# Altium schematic sheet Control and Sample.SchDoc
size 431 x 279 mm; Date: Not shown in title block; ApprovedBy: Not shown in title block; CheckedBy: Not shown in title block; Author: Not shown; CompanyName: Not shown in title block; DrawnBy: Bowen; Engineer: Not shown; Organization: Not shown in title block; Address1: Not shown in title block; Address2: Not shown in title block; Address3: Not shown in title block; Address4: Not shown in title block; DocumentNumber: 2; Revision: Use project parameter SCH_Rev; SheetNumber: 2; SheetTotal: 3; PageSetup: Record=PageOptions|CenterHorizontal=True|CenterVertical=True|PrintScale=1.00|XCorrection=1.00|YCorrection=1.00|PrintKind=0|BorderSize=5000000|LeftOffset=0|BottomOffset=0|Orientation=2|PaperLength=1000|PaperWidth=1000|Scale=100|PaperSource=15|PrintQuality=600|MediaType=1|DitherType=10|PaperKind=Letter|PrintScaleMode=1; CurrentTime: Not shown in title block; CurrentDate: Not shown in title block; Time: Not shown in title block; DocumentFullPathAndName: Not shown in title block; DocumentName: Not shown in title block; ModifiedDate: 1/25/2022; ImagePath: Not shown in title block
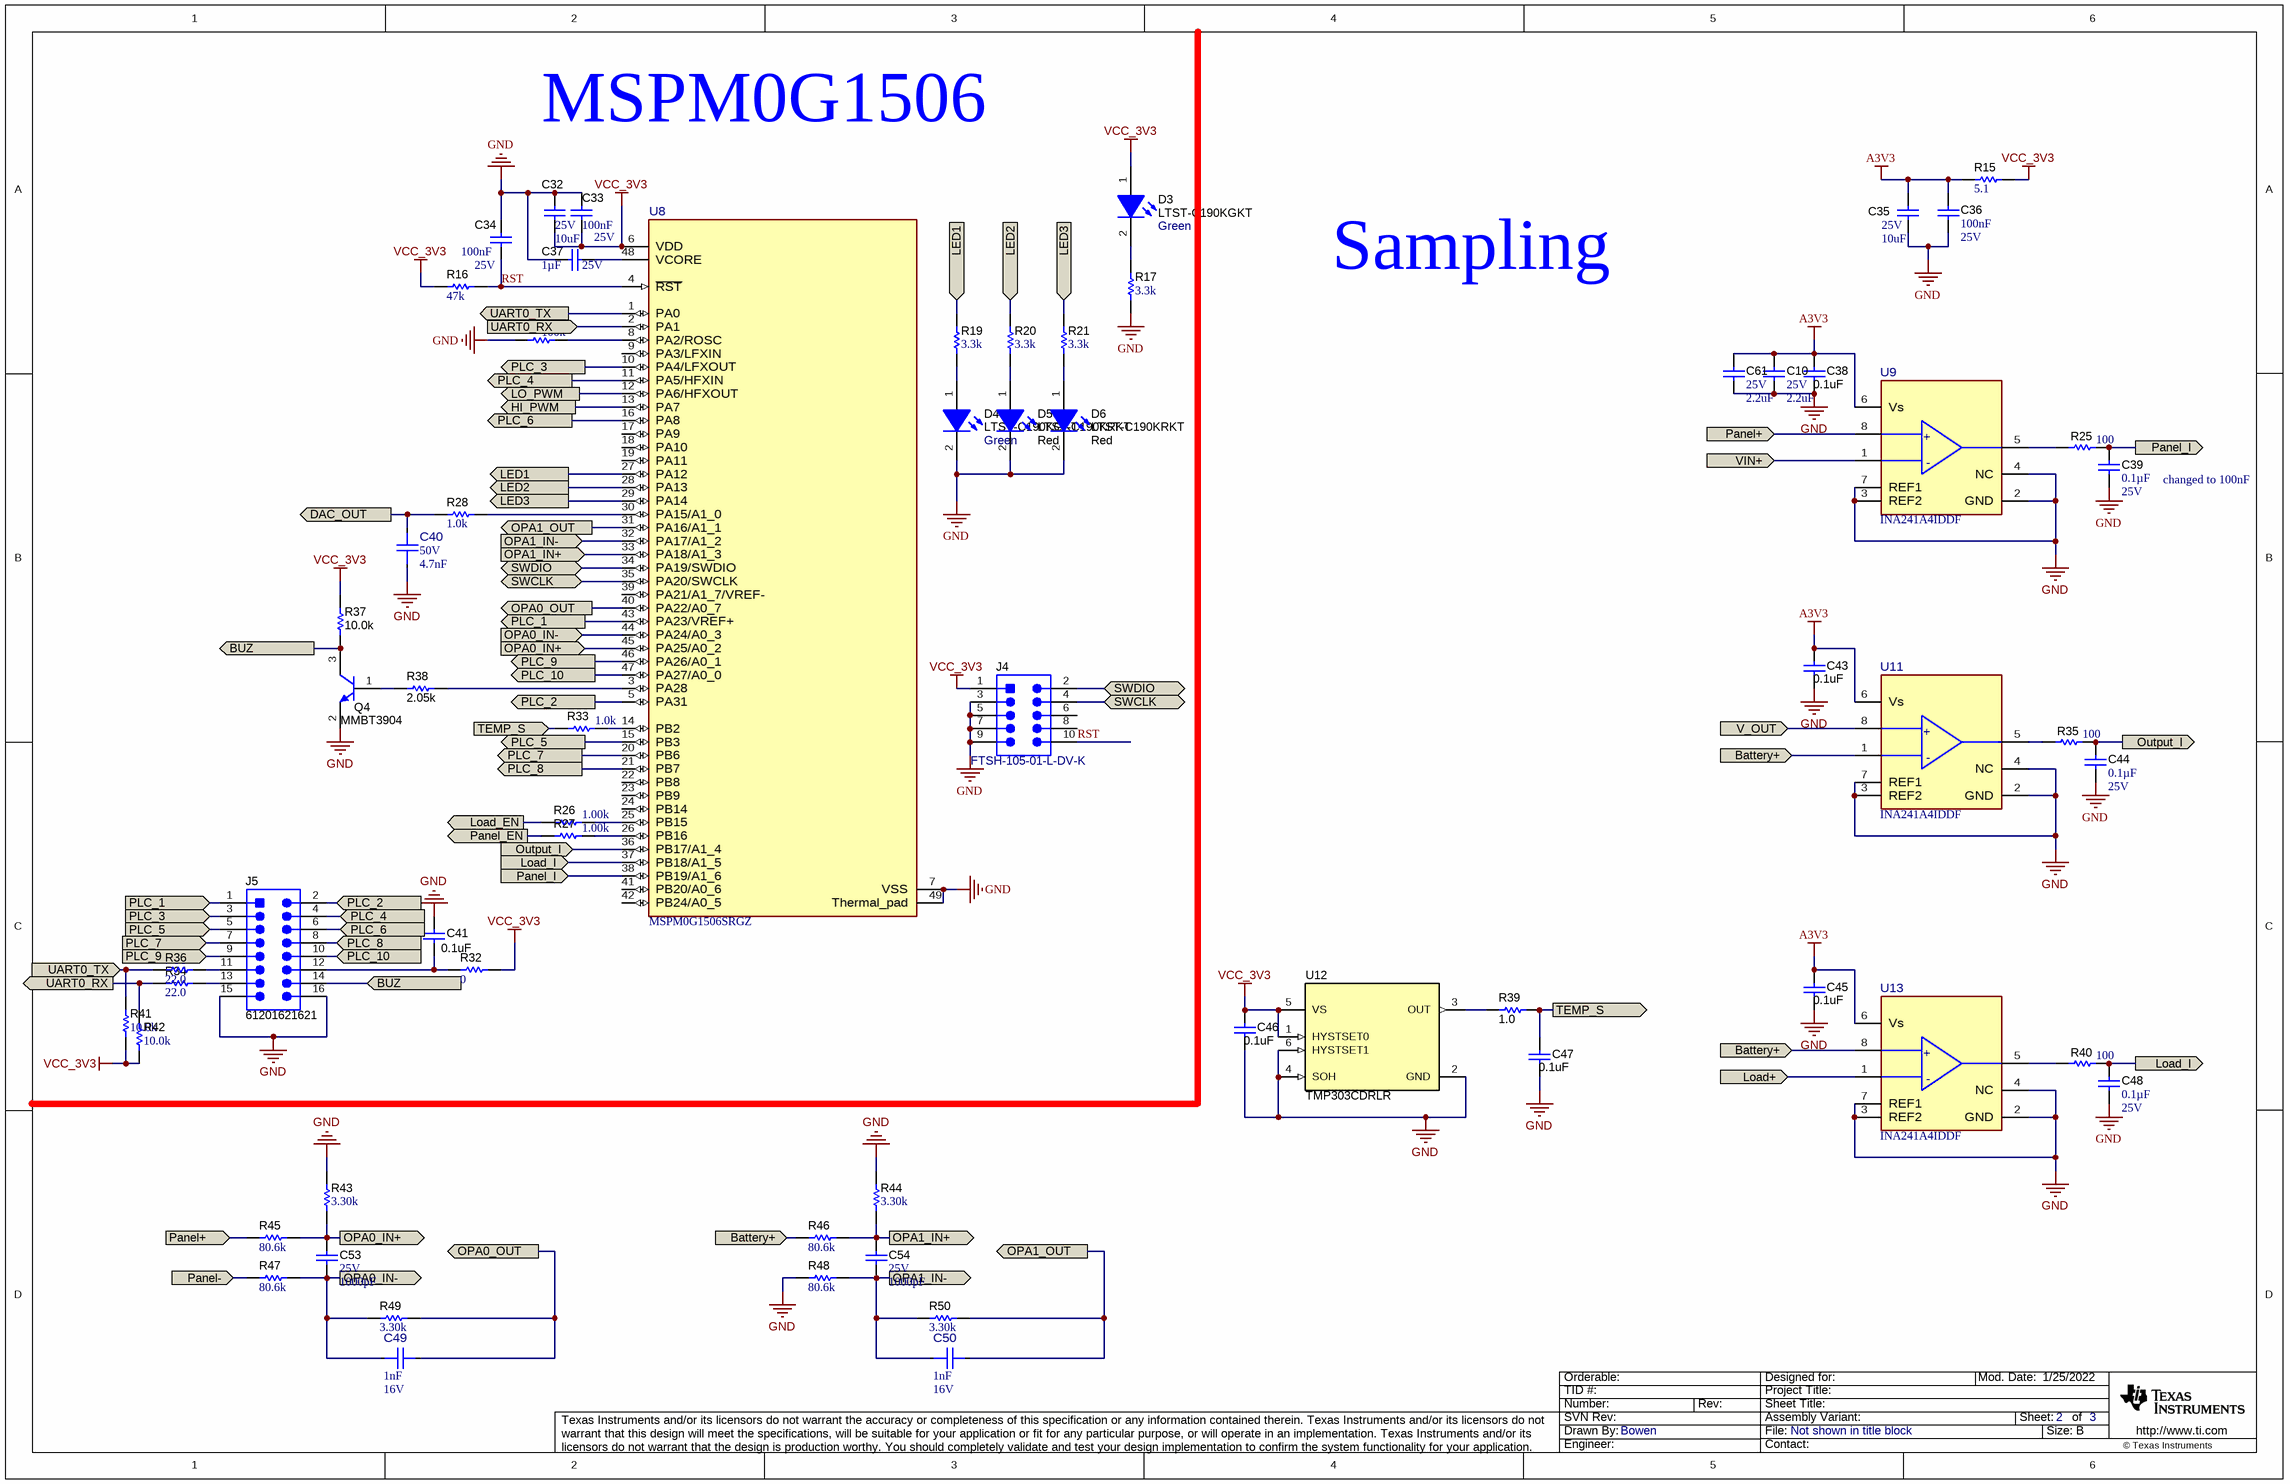
[diagram p0: Control and Sample.SchDoc]

## Parts
C10  VDC_V: 25V  ValueDisplayed: 2.2uF  [0402]  (hidden comment: C1005X5R1E225K050BC)
C32  VDC_V: 25V  ValueDisplayed: 10uF  [1206_180]  (hidden comment: GRM31CR71E106KA12L)
C33  Cap_F: 100nF  VDC_V: 25V  [0603]  (hidden comment: GRM188R71E104KA01D)
C34  Cap_F: 100nF  VDC_V: 25V  [0603]  (hidden comment: GRM188R71E104KA01D)
C35  VDC_V: 25V  ValueDisplayed: 10uF  [1206_180]  (hidden comment: GRM31CR71E106KA12L)
C36  Cap_F: 100nF  VDC_V: 25V  [0603]  (hidden comment: GRM188R71E104KA01D)
C37  Cap_F: 1µF  VDC_V: 25V  [0603]  (hidden comment: 06033C105KAT2A)
C38  ValueDisplayed: 0.1uF  [0603]  (hidden comment: GMK107BJ104KAHT)
C39  ValueDisplayed: 0.1µF  VDC_V: 25V  [0402]  (hidden comment: GCM155L81E104KE02D)
C40  VDC_V: 50V  Cap_F: 4.7nF  [FP-GRM188R71H472KA01B_0603-MFG]  (hidden comment: GRM188R71H472KA01J)
C41  ValueDisplayed: 0.1uF  [0603]  (hidden comment: GMK107BJ104KAHT)
C43  ValueDisplayed: 0.1uF  [0603]  (hidden comment: GMK107BJ104KAHT)
C44  ValueDisplayed: 0.1µF  VDC_V: 25V  [0402]  (hidden comment: GCM155L81E104KE02D)
C45  ValueDisplayed: 0.1uF  [0603]  (hidden comment: GMK107BJ104KAHT)
C46  ValueDisplayed: 0.1uF  [0603]  (hidden comment: GMK107BJ104KAHT)
C47  ValueDisplayed: 0.1uF  [0603]  (hidden comment: GMK107BJ104KAHT)
C48  ValueDisplayed: 0.1µF  VDC_V: 25V  [0402]  (hidden comment: GCM155L81E104KE02D)
C49  Cap_F: 1nF  VDC_V: 16V  [FP-CC0603KRX7R7BB102_0603-MFG]  (hidden comment: CC0603KRX7R7BB102)
C50  Cap_F: 1nF  VDC_V: 16V  [FP-CC0603KRX7R7BB102_0603-MFG]  (hidden comment: CC0603KRX7R7BB102)
C53  VDC_V: 25V  ValueDisplayed: 1000pF  [0402]  (hidden comment: C0402C102J3RACTU)
C54  VDC_V: 25V  ValueDisplayed: 1000pF  [0402]  (hidden comment: C0402C102J3RACTU)
C61  VDC_V: 25V  ValueDisplayed: 2.2uF  [0402]  (hidden comment: C1005X5R1E225K050BC)
D3  LTST-C190KGKT  value Green  [LED_LTST-C190_G]
D4  LTST-C190KGKT  value Green  [LED_LTST-C190_G]
D5  LTST-C190KRKT  value Red  [LED_LTST-C190_Red]
D6  LTST-C190KRKT  value Red  [LED_LTST-C190_Red]
J4  FTSH-105-01-L-DV-K  [Samtec_FTSH-105-01-x-DV-K]
J5  61201621621  [Wurth_61201621621]
Q4  MMBT3904  [SOT-23]
R15  ValueDisplayed: 5.1  [0603]  (hidden comment: CRCW06035R10JNEA)
R16  ValueDisplayed: 47k  [0603]  (hidden comment: RC0603JR-0747KL)
R17  ValueDisplayed: 3.3k  [0603]  (hidden comment: CRCW06033K30JNEA)
R18  ValueDisplayed: 100k  [0603]  (hidden comment: RT0603BRD07100KL)
R19  ValueDisplayed: 3.3k  [0603]  (hidden comment: CRCW06033K30JNEA)
R20  ValueDisplayed: 3.3k  [0603]  (hidden comment: CRCW06033K30JNEA)
R21  ValueDisplayed: 3.3k  [0603]  (hidden comment: CRCW06033K30JNEA)
R25  ValueDisplayed: 100  [0603]  (hidden comment: RC0603FR-07100RL)
R26  ValueDisplayed: 1.00k  [0603]  (hidden comment: RC0603FR-071KL)
R27  ValueDisplayed: 1.00k  [0603]  (hidden comment: RC0603FR-071KL)
R28  ValueDisplayed: 1.0k  [0603]  (hidden comment: RC0603JR-071KL)
R32  ValueDisplayed: 0  [0603]  (hidden comment: RC0603JR-070RL)
R33  ValueDisplayed: 1.0k  [0603]  (hidden comment: RC0603JR-071KL)
R34  ValueDisplayed: 22.0  [0603]  (hidden comment: RC0603FR-0722RL)
R35  ValueDisplayed: 100  [0603]  (hidden comment: RC0603FR-07100RL)
R36  ValueDisplayed: 22.0  [0603]  (hidden comment: RC0603FR-0722RL)
R37  ValueDisplayed: 10.0k  [0603]  (hidden comment: ERJ-3EKF1002V)
R38  ValueDisplayed: 2.05k  [0603]  (hidden comment: RC0603FR-072K05L)
R39  ValueDisplayed: 1.0  [0603]  (hidden comment: CRCW06031R00JNEA)
R40  ValueDisplayed: 100  [0603]  (hidden comment: RC0603FR-07100RL)
R41  ValueDisplayed: 10.0k  [0603]  (hidden comment: RMCF0603FT10K0)
R42  ValueDisplayed: 10.0k  [0603]  (hidden comment: RMCF0603FT10K0)
R43  ValueDisplayed: 3.30k  [0603]  (hidden comment: CRCW06033K30FKEA)
R44  ValueDisplayed: 3.30k  [0603]  (hidden comment: CRCW06033K30FKEA)
R45  ValueDisplayed: 80.6k  [0603]  (hidden comment: RC0603FR-0780K6L)
R46  ValueDisplayed: 80.6k  [0603]  (hidden comment: RC0603FR-0780K6L)
R47  ValueDisplayed: 80.6k  [0603]  (hidden comment: RC0603FR-0780K6L)
R48  ValueDisplayed: 80.6k  [0603]  (hidden comment: RC0603FR-0780K6L)
R49  ValueDisplayed: 3.30k  [0603]  (hidden comment: CRCW06033K30FKEA)
R50  ValueDisplayed: 3.30k  [0603]  (hidden comment: CRCW06033K30FKEA)
U8  MSPM0G1506SRGZ  [RGZ0048B-MFG]
U9  INA241A4IDDF  [DDF0008A-MFG]
U11  INA241A4IDDF  [DDF0008A-MFG]
U12  TMP303CDRLR  [DRL0006A]
U13  INA241A4IDDF  [DDF0008A-MFG]

## Ports
Battery+ (in), BUZ (in), BUZ (out), DAC_OUT (out), HI_PWM (out), LED1 (in), LED1 (out), LED2 (in), LED2 (out), LED3 (in), LED3 (out), LO_PWM (out), Load+ (in), Load_EN (out), Load_I (in), Load_I (out), OPA0_IN+ (in), OPA0_IN+ (out), OPA0_IN- (in), OPA0_IN- (out), OPA0_OUT (out), OPA1_IN+ (in), OPA1_IN+ (out), OPA1_IN- (in), OPA1_IN- (out), OPA1_OUT (out), Output_I (in), Output_I (out), Panel+ (in), Panel- (in), Panel_EN (out), Panel_I (in), Panel_I (out), PLC_1 (in), PLC_1 (out), PLC_2 (in), PLC_2 (out), PLC_3 (in), PLC_3 (out), PLC_4 (in), PLC_4 (out), PLC_5 (in), PLC_5 (out), PLC_6 (in), PLC_6 (out), PLC_7 (in), PLC_7 (out), PLC_8 (in), PLC_8 (out), PLC_9 (in), PLC_9 (out), PLC_10 (in), PLC_10 (out), SWCLK (bidir), SWDIO (bidir), TEMP_S (in), TEMP_S (out), UART0_RX (in), UART0_RX (out), UART0_TX (in), UART0_TX (out), V_OUT (in), VIN+ (in)

## Nets
A3V3: C10.1 C35.1 C36.1 C38.1 C43.1 C45.1 C61.1 R15.1 U9.6(Vs) U11.6(Vs) U13.6(Vs)
GND: C10.2 C32.1 C33.1 C34.1 C35.2 C36.2 C37.1 C38.2 C39.2 C40.1 C41.1 C43.2 C44.2 C45.2 C46.2 C47.2 C48.2 C61.2 D4.2(K) D5.2(K) D6.2(K) J4.3 J4.5 J4.7 J4.9 J5.15 J5.16 Q4.2(E) R17.1 R18.1 R43.2 R44.2 R48.1 U8.7(VSS) U8.49(Thermal_pad) U9.2(GND) U9.3(REF2) U9.4(NC) U9.7(REF1) U11.2(GND) U11.3(REF2) U11.4(NC) U11.7(REF1) U12.2(GND) U12.4(SOH) U12.6(HYSTSET1) U13.2(GND) U13.3(REF2) U13.4(NC) U13.7(REF1)
VCC_3V3: C32.2 C33.2 C46.1 D3.1(A) J4.1 R15.2 R16.1 R32.2 R37.1 R41.1 R42.1 U8.6(VDD) U12.1(HYSTSET0) U12.5(VS)
Battery+: R46.1 U11.1(IN-) U13.8(IN+) ; port Battery+
BUZ: J5.14 Q4.3(C) R37.2 ; port BUZ
DAC_OUT: C40.2 R28.1 ; port DAC_OUT
HI_PWM: U8.13(PA7) ; port HI_PWM
LED1: R19.1 U8.27(PA12) ; port LED1
LED2: R20.1 U8.28(PA13) ; port LED2
LED3: R21.1 U8.29(PA14) ; port LED3
LO_PWM: U8.12(PA6/HFXOUT) ; port LO_PWM
Load+: U13.1(IN-) ; port Load+
Load_EN: R26.1 ; port Load_EN
Load_I: C48.1 R40.2 U8.37(PB18/A1_5) ; port Load_I
OPA0_IN+: C53.1 R43.1 R45.2 U8.45(PA25/A0_2) ; port OPA0_IN+
OPA0_IN-: C49.1 C53.2 R47.2 R49.1 U8.44(PA24/A0_3) ; port OPA0_IN-
OPA0_OUT: C49.2 R49.2 U8.40(PA22/A0_7) ; port OPA0_OUT
OPA1_IN+: C54.1 R44.1 R46.2 U8.33(PA18/A1_3) ; port OPA1_IN+
OPA1_IN-: C50.1 C54.2 R48.2 R50.1 U8.32(PA17/A1_2) ; port OPA1_IN-
OPA1_OUT: C50.2 R50.2 U8.31(PA16/A1_1) ; port OPA1_OUT
Output_I: C44.1 R35.2 U8.36(PB17/A1_4) ; port Output_I
Panel+: R45.1 U9.8(IN+) ; port Panel+
Panel-: R47.1 ; port Panel-
Panel_EN: R27.1 ; port Panel_EN
Panel_I: C39.1 R25.2 U8.38(PB19/A1_6) ; port Panel_I
PLC_1: J5.1 U8.43(PA23/VREF+) ; port PLC_1
PLC_2: J5.2 U8.5(PA31) ; port PLC_2
PLC_3: J5.3 U8.10(PA4/LFXOUT) ; port PLC_3
PLC_4: J5.4 U8.11(PA5/HFXIN) ; port PLC_4
PLC_5: J5.5 U8.15(PB3) ; port PLC_5
PLC_6: J5.6 U8.16(PA8) ; port PLC_6
PLC_7: J5.7 U8.20(PB6) ; port PLC_7
PLC_8: J5.8 U8.21(PB7) ; port PLC_8
PLC_9: J5.9 U8.46(PA26/A0_1) ; port PLC_9
PLC_10: J5.10 U8.47(PA27/A0_0) ; port PLC_10
RST: C34.2 J4.10 R16.2 U8.4(~{RST})
SWCLK: J4.4 U8.35(PA20/SWCLK) ; port SWCLK
SWDIO: J4.2 U8.34(PA19/SWDIO) ; port SWDIO
TEMP_S: C47.1 R33.1 R39.2 ; port TEMP_S
UART0_RX: R34.1 R42.2 U8.2(PA1) ; port UART0_RX
UART0_TX: R36.1 R41.2 U8.1(PA0) ; port UART0_TX
V_OUT: U11.8(IN+) ; port V_OUT
VIN+: U9.1(IN-) ; port VIN+
NetC37_2: C37.2 U8.48(VCORE)
NetC41_2: C41.2 J5.12 R32.1
NetD3_2: D3.2(K) R17.2
NetD4_1: D4.1(A) R19.2
NetD5_1: D5.1(A) R20.2
NetD6_1: D6.1(A) R21.2
NetJ5_11: J5.11 R36.2
NetJ5_13: J5.13 R34.2
NetQ4_1: Q4.1(B) R38.1
NetR18_2: R18.2 U8.8(PA2/ROSC)
NetR25_1: R25.1 U9.5(OUT)
NetR26_2: R26.2 U8.25(PB15)
NetR27_2: R27.2 U8.26(PB16)
NetR28_2: R28.2 U8.30(PA15/A1_0)
NetR33_2: R33.2 U8.14(PB2)
NetR35_1: R35.1 U11.5(OUT)
NetR38_2: R38.2 U8.3(PA28)
NetR39_1: R39.1 U12.3(OUT)
NetR40_1: R40.1 U13.5(OUT)

Not connected (* = marked no-connect by the designer): J4 6 8; U8 9(PA3/LFXIN) 17(PA9) 18(PA10) 19(PA11) 22(PB8) 23(PB9) 24(PB14) 39(PA21/A1_7/VREF-) 41(PB20/A0_6) 42(PB24/A0_5)

## Notes on the sheet
- MSPM0G1506
- Sampling
- changed to 100nF
- Drawn By:
- SVN Rev:
- Number:
- TID #:
- Orderable:
- Rev:
- Sheet Title:
- File:
- Project Title:
- Designed for:
- Assembly Variant:
- Mod. Date:
- Sheet:
- Size:
- of
- B
- http://www.ti.com
- Texas Instruments and/or its licensors do not warrant the accuracy or completeness of this specification or any information contained therein. Texas Instruments and/or its licensors do not warrant that this design will meet the specifications, will be suitable for your application or fit for any particular purpose, or will operate in an implementation. Texas Instruments and/or its licensors do not warrant that the design is production worthy. You should completely validate and test your design implementation to confirm the system functionality for your application.
- Engineer:
- Contact:
- © Texas Instruments
- (in symbol CMP-0093650-2) +; -

## Library data of the parts
C10 C61 = CMP-0006278-2: CAP, CERM, 2.2 uF, 25 V, +/- 10%, X5R, 0402; Manufacturer: TDK; TaMin_C: -55°C; Polarized: N; SizeAreaWB_mm2: 3; Value1: Unknown; U/M: EA; Value: 2.2uF; TaMax_C: 85°C; SizeZ_mm: 0.6; SizeX_mm: 1; SizeY_mm: 0.5; Cap_F: 2.2µF; AEC Category: Q200; Supplier Part Number 2: 07W9129; Publisher: Texas Instruments; Supplier 2: Newark; TempCo: X5R; Published: 2008-06-19; RoHS: Y; MountType: SMT; Supplier 1: Digi-Key; PackageReference: 0402; Tolerance_%: 10%; Cap_Case: 0402; Value2: 25V; SizeArea_mm2: 0.5; CompType: Capacitor; LatestRevisionDate: 2017-03-09; PartNumber: C1005X5R1E225K050BC; AEC Qualified: ?; ComponentLink1Description: Datasheet link; Supplier Part Number 1: 445-9090-1-ND; Technology: Ceramic; ComponentLink1URL: http://www.tdk.com/pdf/TDKMLCCCapRange.pdf
C32 C35 = CMP-0008965-2: CAP, CERM, 10 uF, 25 V, +/- 10%, X7R, 1206; Manufacturer: MuRata; TaMin_C: -55°C; Polarized: N; SizeAreaWB_mm2: 10.92; Value1: Unknown; U/M: EA; Value: 10uF; TaMax_C: 125°C; SizeZ_mm: 1.8; SizeX_mm: 3.2; SizeY_mm: 1.6; Cap_Case: 2220; SizeArea_mm2: 5.12; Cap_F: 10µF; AEC Category: Q200; Supplier Part Number 2: 1828837; Publisher: Texas Instruments; Supplier 2: Farnell; TempCo: X7R; Published: 2008-06-19; RoHS: Y; MountType: SMT; Supplier 1: Mouser; PackageReference: 1206; Tolerance_%: 10%; Value2: 25V; CompType: Capacitor; LatestRevisionDate: 2017-03-09; PartNumber: GRM31CR71E106KA12L; AEC Qualified: ?; ComponentLink1Description: Datasheet link; Supplier Part Number 1: 81-GRM31CR71E106KA12; Technology: Ceramic; ComponentLink1URL: http://search.murata.co.jp/Ceramy/PnsearchViewAction.do?HnOFG=ON&HnNFG=ON&SEL_CNT=50&sLang=en&sKey=GRM31CR71E106KA12L&x=9&y=9&search=startwith
C33 C34 C36 = CMP-0007404-2: CAP, CERM, 0.1 uF, 25 V, +/- 10%, X7R, 0603; Manufacturer: MuRata; TaMin_C: -55°C; Polarized: N; SizeAreaWB_mm2: 4.68; Value1: Unknown; U/M: EA; Value: 0.1uF; TaMax_C: 125°C; SizeZ_mm: 1; SizeX_mm: 1.6; SizeY_mm: 0.8; SizeArea_mm2: 1.28; AEC Category: Q200; Supplier Part Number 2: 81-GRM39X104K25; Publisher: Texas Instruments; Supplier 2: Mouser; Supplier Part Number 3: 1828899; TempCo: X7R; Supplier 3: Farnell; Published: 2008-06-19; RoHS: Y; MountType: SMT; Supplier 1: Digi-Key; PackageReference: 0603; Tolerance_%: 10%; Cap_Case: 0603; Value2: 25V; CompType: Capacitor; LatestRevisionDate: 2017-03-09; PartNumber: GRM188R71E104KA01D; AEC Qualified: ?; ComponentLink1Description: Datasheet link; Supplier Part Number 1: 490-1524-1-ND; Technology: Ceramic; ValueDisplayed: 0.1uF; ComponentLink1URL: http://search.murata.co.jp/Ceramy/PnsearchViewAction.do?HnOFG=ON&HnNFG=ON&SEL_CNT=50&sLang=en&sKey=GRM188R71E104KA01D&x=9&y=9&search=startwith
C37 = CMP-0006754-4: CAP, CERM, 1 uF, 25 V, +/- 10%, X7R, 0603; Manufacturer: AVX; TaMin_C: -55°C; Polarized: N; SizeAreaWB_mm2: 4.68; Value1: Unknown; U/M: EA; Value: 1uF; TaMax_C: 125°C; SizeZ_mm: 1; SizeX_mm: 1.6; SizeY_mm: 0.8; SizeArea_mm2: 1.28; AEC Category: Q200; Supplier Part Number 2: 44X0680; Publisher: Texas Instruments; Supplier 2: Newark; Supplier Part Number 3: 581-06033C105KAT2A; TempCo: X7R; Supplier 3: Mouser; Published: 2008-06-19; RoHS: Y; MountType: SMT; Supplier 1: Digi-Key; PackageReference: 0603; Tolerance_%: 10%; Cap_Case: 0603; Value2: 25V; CompType: Capacitor; LatestRevisionDate: 2017-03-09; PartNumber: 06033C105KAT2A; AEC Qualified: N; ComponentLink1Description: Datasheet link; AEC Grade: N/A; Supplier Part Number 1: 478-10046-1-ND; Technology: Ceramic; ValueDisplayed: 1uF; ComponentLink1URL: http://datasheets.avx.com/X7RDielectric.pdf
C38 C41 C43 C45-C47 = CMP-0007044-5: CAP CER 0.1UF 25V X5R 0603; Manufacturer: Taiyo Yuden; PartNumber: TMK107BJ104KA-T; TaMin_C: -55°C; ESR_ohm: 0.0296; Polarized: N; TempCo: X7R; SizeAreaWB_mm2: 4.68; Value1: 0.0296 ohm; U/M: EA; TaMax_C: 125°C; Tolerance_%: 10%; SizeZ_mm: 1; SizeX_mm: 1.6; SizeY_mm: 0.8; SizeArea_mm2: 1.28; CompType: Capacitor; Cap_F: 100nF; IRMS_A: 9.7199dA; AEC Category: Q200; Publisher: Texas Instruments; Published: 2008-06-19; RoHS: Y; MountType: SMT; Value: 0.1uF; Supplier 1: Digi-Key; PackageReference: 0603; Cap_Case: 0603; Value2: 25V; LatestRevisionDate: 2017-03-09; AEC Qualified: N; VDC_V: 25V; ComponentLink1Description: Datasheet link; AEC Grade: N/A; Supplier Part Number 1: 587-1245-1-ND; Technology: Ceramic; ComponentLink1URL: https://product.tdk.com/en/search/capacitor/ceramic/mlcc/info?part_no=C1608X7R1H104K080AA
C39 C44 C48 = CMP-0861000-1: CAP, CERM, 0.1 µF, 25 V,+/- 10%, X8L, AEC-Q200 Grade 0, 0402; Manufacturer: MuRata; U/M: EA; Polarized: N; Cap_F: 100nF; SizeZ_mm: 0.6; SizeY_mm: 0.5; Value: 0.1uF; SizeX_mm: 1; AEC Qualified: Y; AEC Grade: 0; SizeAreaWB_mm2: 3; AEC Category: Q200; TaMin_C: -55°C; TaMax_C: 150°C; ComponentLink1Description: Datasheet link; PackageReference: 0402; TempCo: X8L; PartNumber: GCM155L81E104KE02D; SizeArea_mm2: 0.5; Cap_Case: 0402; ComponentLink1URL: https://psearch.en.murata.com/capacitor/product/GCM155L81E104KE02%23.pdf; Tolerance_%: 10%; Value2: 25V; RoHS: Y; MountType: SMT; CompType: Capacitor; Technology: Ceramic
C40 = CMP-0095442-1: Multilayer Ceramic Capacitors MLCC - SMD/SMT 0603 4700pF 50volt X7R +/-10%; Part Number: GRM188R71H472KA01B; Manufacturer: Murata; Obsolete Part: true; Value: 4.7nF; SizeZ_mm: 0.9mm; Tolerance_%: 10%; TempCo: 15%; AEC Qualified: No; PackageReference: 0603; Supplier 2: Mouser; Mouser Part Number: 81-GRM18R71H472KA01B; datasheet: https://www.mouser.com/datasheet/2/281/murata_03052018_GRM_Series_1-1310166.pdf; ComponentLink1Description: Datasheet; ValueDisplayed: 4.7nF; helpURL: https://upverter.com/upn/revision/abd90d6f327844e2/; ComponentLink1URL: https://www.mouser.com/datasheet/2/281/murata_03052018_GRM_Series_1-1310166.pdf; Lead Free: Yes; Supplier Part Number 2: 81-GRM18R71H472KA01B; Mouser Description: Multilayer Ceramic Capacitors MLCC - SMD/SMT 0603 4700pF 50volt X7R +/-10%; Temperature Characteristic: X7R; Operating Temperature Range: -55°C to +125°C; PartNumber: GRM188R71H472KA01B; RoHS: TRUE; Datasheet Path: datasheets/Cap-GRM188R71H472KA01B.pdf
C49 C50 = CMP-0094870-1: 1000 pF ±10% 16V Ceramic Capacitor X7R 0603 (1608 Metric); Manufacturer: YAGEO; AEC Qualified: No; Value: 1nF; ValueDisplayed: 1.0 nF; TempCo: 15%; SizeZ_mm: 0.9mm; Mouser Part Number: 603-CC603KRX7R7BB102; Datasheet Path: datasheets/Cap-CC0603KRX7R7BB102.pdf; RoHS: TRUE; ComponentLink1URL: https://www.yageo.com/upload/media/product/productsearch/datasheet/mlcc/UPY-GPHC_X7R_6.3V-to-50V_20.pdf; Lead Free: Yes; Digikey Part Number: 311-4063-1-ND; Voltage: 16V; PartNumber: CC0603KRX7R7BB102; Mouser Description: 0603 1 nF 16 V ±10 % Tolerance X7R SMT Multilayer Ceramic Capacitor; Supplier Part Number 2: 603-CC603KRX7R7BB102; ComponentLink1Description: Datasheet; Supplier 1: Digikey; Digikey Description: CAP CER 1000PF 16V X7R 0603; PackageReference: 0603; Part Number: CC0603KRX7R7BB102; Tolerance_%: 10%; Supplier 2: Mouser; datasheet: https://www.yageo.com/upload/media/product/productsearch/datasheet/mlcc/UPY-GPHC_X7R_6.3V-to-50V_20.pdf; Supplier Part Number 1: 311-4063-1-ND; helpURL: https://upverter.com/upn/revision/f0b8942f5b16e97c/; Operating Temperature Range: -55°C to +125°C; Temperature Characteristic: X7R
C53 C54 = CMP-0006234-2: CAP, CERM, 1000 pF, 25 V, +/- 5%, X7R, 0402; Manufacturer: Kemet; TaMin_C: -55°C; Polarized: N; SizeAreaWB_mm2: 3; Value1: Unknown; U/M: EA; Value: 1000pF; TaMax_C: 125°C; SizeZ_mm: 0.6; SizeX_mm: 1; SizeY_mm: 0.5; Cap_F: 1nF; AEC Category: Q200; Supplier Part Number 2: 78H4764; Publisher: Texas Instruments; Supplier 2: Newark; Supplier Part Number 3: 80-C0402C102J3R; TempCo: X7R; Supplier 3: Mouser; Published: 2008-06-19; RoHS: Y; MountType: SMT; Supplier 1: Digi-Key; PackageReference: 0402; Tolerance_%: 5%; Cap_Case: 0402; Value2: 25V; SizeArea_mm2: 0.5; CompType: Capacitor; LatestRevisionDate: 2017-03-09; PartNumber: C0402C102J3RACTU; AEC Qualified: ?; ComponentLink1Description: Datasheet link; Supplier Part Number 1: 399-7752-1-ND; Technology: Ceramic; ComponentLink1URL: http://www.kemet.com/Lists/ProductCatalog/Attachments/53/KEM_C1002_X7R_SMD.pdf
D3 D4 = CMP-0002840-2: LED, Green, SMD; Manufacturer: Lite-On; Value1: W; Io_A: 30mA; Value2: 2V; Tjmax_C: 85°C; Type: AlInGaP; PartNumber: LTST-C190KGKT; MountType: SMT; CompType: LED; Color: green; ComponentLink1Description: Datasheet link; RoHS: Y; ComponentLink1URL: http://optoelectronics.liteon.com/en-us/api/DwonloadFileHandler.ashx?txtSpecNo=DS22-2000-074&txtPartNo=LTST-C190KGKT; Vf_V: 2V; PackageReference: 1.6x0.8x0.8mm
D5 D6 = CMP-0078131-2: LED, Red, SMD; Manufacturer: Lite-On; Type: AlInGaP; Ir_A: 10µA; Angle: 130; Power_TotalModule: 62.5mW; Value2: 2V; Green_Lifecycle: Not Set; Io_A: 20mA; Value1: .0625W; Green_REACh: Incomplete; Vr_V: 5V; Green_EU RoHS: Incomplete; Green_EU RoHS-2: Incomplete; CompType: LED; Color: Red; ComponentLink1URL: http://optoelectronics.liteon.com/upload/download/DS-22-99-0151/LTST-C190KRKT.pdf; RoHS: Y; Vf_V: 2V; PackageReference: Red LED, 1.6x0.8x0.8mm; ComponentLink1Description: Datasheet link; PartNumber: LTST-C190KRKT; MountType: SMT
J4 = CMP-0075634-1: Header(Shrouded), 1.27mm, 5x2, Gold, SMT; Manufacturer: Samtec; Pitch_mm: 1.27; Gender: Male; Cert_CSA: Y; Current_A: 3.3A; CT: False; Row_Count: 2; ComponentLink1Description: Datasheet URL; RoHS: Y; Supplier 1: Digi-Key; Cert_UL: Y; Orientation: Vertical; PackageReference: Header(Shrouded), 1.27mm, 5x2, SMT; Color: Black; PartNumber: FTSH-105-01-L-DV-K; PinCount: 10; Publisher: Texas Instruments; Supplier Part Number 2: 1872577; ContactFinish: Gold; Supplier 2: Farnell; Shrouded: Y; RowSpacing_mm: 1.27; ComponentLink1URL: http://suddendocs.samtec.com/prints/ftsh-1xx-xx-xxx-dv-xxx-mkt.pdf; LatestRevisionDate: 2017-07-12; CompType: Header; CNHeader: False; MountType: SMT; Supplier Part Number 1: SAM8799-ND
J5 = CMP-0054761-1: Header(Shrouded), 2.54mm, 8x2, Gold, TH; Manufacturer: Wurth Elektronik; CNHeader: FALSE; Shrouded: Y; Gender: Male; Row_Count: 2; RowSpacing_mm: 2.54; ComponentLink1URL: http://katalog.we-online.de/em/datasheet/6120xx21621.pdf; Supplier Part Number 2: 19P1271; Publisher: Texas Instruments; Supplier 2: Newark; Supplier Part Number 3: 710-61201621621; Color: Black; Supplier 3: Mouser; RoHS: Y; MountType: TH; Supplier 1: Digi-Key; PackageReference: Header, 2.54mm, 8X2, TH; PinCount: 16; CompType: Header; LatestRevisionDate: 26/05/2017; PartNumber: 61201621621; Orientation: Vertical; ComponentLink1Description: Datasheet URL; Supplier Part Number 1: 732-2095-ND; Pitch_mm: 2.54; ContactFinish: Gold; CT: FALSE
Q4 = CMP-0000386-2: TRANS NPN 40V 0.2A SOT23; PartNumber: MMBT3904-TP; Manufacturer: Micro Commercial Co; TaMax_C: 150°C; Value2: 300; Vcesat1_V: 2dV; SizeX_mm: 2.5; SizeY_mm: 3; TaMin_C: -55°C; IcRated_A: 2dA; CompType: BJT; SizeZ_mm: 1.1; SizeArea_mm2: 7.5; NPN: 1; PNP: 0; AEC Category: Q101; SizeAreaWB_mm2: 14; U/M: EA; Supplier 1: Digi-Key; Supplier Part Number 1: MMBT3904TPMSCT-ND; Value1: 0.2 A; LatestRevisionDate: 2017-03-09; Publisher: Texas Instruments; AEC Qualified: ?; ComponentLink1Description: Datasheet link; HfeMax: 300; Value: 40 V; Published: 2008-07-31; RoHS: Y; Vceo_V: 40V; PackageReference: SOT-23; MountType: SMT; ComponentLink1URL: http://www.fairchildsemi.com/ds/MM/MMBT3904.pdf
R15 = CMP-0025834-2: RES, 5.1, 5%, 0.1 W, 0603; Manufacturer: Vishay-Dale; Power_W: 100mW; TempCo: 200 ppm/C; Value_Code: 5R10; U/M: EA; Value: 5.1; EIA_Code: E24; SizeX_mm: 1.6; SizeY_mm: 0.8; SizeZ_mm: 1; Value2: 0.1W; SizeArea_mm2: 1.28; VDC_V: 75V; AEC Category: Q200; Supplier Part Number 2: 59M6820; Publisher: Texas Instruments; Supplier 2: Newark; Supplier Part Number 3: 71-CRCW0603J-5.1-E3; Supplier 3: Mouser; Published: 2008-06-26; RoHS: Y; Value1: 5%; MountType: SMT; Supplier 1: Digi-Key; PackageReference: 0603; Tolerance_%: 5%; Res_ohm: 5.1; CompType: Resistor; LatestRevisionDate: 2017-03-09; PartNumber: CRCW06035R10JNEA; AEC Qualified: ?; ComponentLink1Description: Datasheet link; Supplier Part Number 1: 541-5.1GCT-ND; Technology: Thick Film; ComponentLink1URL: http://www.vishay.com/docs/20035/dcrcwe3.pdf
R16 = CMP-0025925-5: RES, 47 k, 5%, 0.1 W, 0603; Manufacturer: Yageo; Power_W: 100mW; TempCo: 100 ppm/C; Value_Code: 47k0; Value: 47k; EIA_Code: E24; SizeX_mm: 1.6; SizeY_mm: 0.8; SizeZ_mm: 1; Value2: 0.1W; SizeArea_mm2: 1.28; AEC Qualified: N; VDC_V: 75V; AEC Category: Q200; SizeAreaWB_mm2: 4.68; Supplier Part Number 2: 603-RC0603JR-0747KL; Supplier 2: Mouser; Supplier Part Number 3: 9233580; Supplier 3: Farnell; RoHS: Y; Value1: 5%; MountType: SMT; Supplier 1: Digi-Key; PackageReference: 0603; Tolerance_%: 5%; Res_ohm: 47k; CompType: Resistor; PartNumber: RC0603JR-0747KL; ComponentLink1Description: Datasheet link; Supplier Part Number 1: 311-47KGRCT-ND; Technology: Thick Film; ComponentLink1URL: http://www.yageo.com/pdf/Pu-RC0603_51_PbFree_L_2.pdf; AEC Grade: N/A
R17 R19-R21 = CMP-0025797-4: RES, 3.3 k, 5%, 0.1 W, AEC-Q200 Grade 0, 0603; Manufacturer: Vishay-Dale; Power_W: 100mW; TempCo: 200 ppm/C; Value_Code: 3k30; Value: 3.3k; EIA_Code: E24; SizeX_mm: 1.6; SizeY_mm: 0.8; SizeZ_mm: 1; Value2: 0.1W; SizeArea_mm2: 1.28; AEC Qualified: Y; VDC_V: 75V; AEC Category: Q200; AEC Grade: 0; Supplier Part Number 2: 59M6796; Supplier 2: Newark; Supplier Part Number 3: 71-CRCW0603J-3.3K-E3; Supplier 3: Mouser; RoHS: E; Value1: 5%; MountType: SMT; Supplier 1: Digi-Key; PackageReference: 0603; Tolerance_%: 5%; Res_ohm: 3.3k; CompType: Resistor; PartNumber: CRCW06033K30JNEA; ComponentLink1Description: Datasheet link; Supplier Part Number 1: 541-3.3KGCT-ND; Technology: Thick Film; ComponentLink1URL: http://www.vishay.com/docs/20035/dcrcwe3.pdf
R18 = CMP-0023630-1: RES, 100 k, 0.1%, 0.1 W, 0603; Manufacturer: Yageo America; Power_W: 100mW; TempCo: 25 ppm/C; U/M: EA; Value: 100k; EIA_Code: E192; SizeX_mm: 1.6; SizeY_mm: 0.8; SizeZ_mm: 1; Value2: 0.1W; SizeArea_mm2: 1.28; VDC_V: 75V; AEC Category: Q200; ComponentLink1URL: http://www.yageo.com/pdf/PYu-RT_1-to-0.05_RoHS_L_3.pdf; Publisher: Texas Instruments; Published: 2008-06-26; Value_Code: 100k; RoHS: Y; Value1: 0.1%; MountType: SMT; Supplier 1: Mouser; PackageReference: 0603; Tolerance_%: 0.1%; Res_ohm: 100k; CompType: Resistor; LatestRevisionDate: 2017-03-09; PartNumber: RT0603BRD07100KL; AEC Qualified: ?; ComponentLink1Description: Datasheet link; Supplier Part Number 1: 603-RT0603BRD07100KL; Technology: Thin Film
R25 R35 R40 = CMP-0022736-4: RES, 100, 1%, 0.1 W, 0603; Manufacturer: Yageo; Power_W: 100mW; TempCo: 100 ppm/C; Value_Code: 100R; Value: 100; EIA_Code: E96; SizeX_mm: 1.6; SizeY_mm: 0.8; SizeZ_mm: 1; Value2: 0.1W; SizeArea_mm2: 1.28; AEC Qualified: N; VDC_V: 75V; AEC Category: Q200; SizeAreaWB_mm2: 4.68; ComponentLink1URL: http://www.yageo.com/pdf/Pu-RC0603_51_PbFree_L_2.pdf; Supplier Part Number 2: 603-RC0603FR-07100RL; Supplier 2: Mouser; Supplier Part Number 3: 9238360; Supplier 3: Farnell; RoHS: Y; Value1: 1%; MountType: SMT; Supplier 1: Digi-Key; PackageReference: 0603; Tolerance_%: 1%; Res_ohm: 100; CompType: Resistor; PartNumber: RC0603FR-07100RL; ComponentLink1Description: Datasheet link; Supplier Part Number 1: 311-100HRCT-ND; Technology: Thick Film; AEC Grade: N/A
R26 R27 = CMP-0022895-5: RES, 1.00 k, 1%, 0.1 W, 0603; Manufacturer: Yageo; Power_W: 100mW; TempCo: 100 ppm/C; Value_Code: 1k00; Value: 1.00k; EIA_Code: E96; Res_ohm: 1k; SizeX_mm: 1.6; SizeY_mm: 0.8; SizeZ_mm: 1; Value2: 0.1W; SizeArea_mm2: 1.28; AEC Qualified: N; VDC_V: 75V; AEC Category: Q200; SizeAreaWB_mm2: 4.68; Supplier Part Number 2: 603-RC0603FR-071KL; Supplier 2: Mouser; Supplier Part Number 3: 9238484; Supplier 3: Farnell; RoHS: Y; Value1: 1%; MountType: SMT; Supplier 1: Digi-Key; PackageReference: 0603; Tolerance_%: 1%; CompType: Resistor; PartNumber: RC0603FR-071KL; ComponentLink1Description: Datasheet link; Supplier Part Number 1: 311-1.00KHRCT-ND; Technology: Thick Film; ComponentLink1URL: http://www.yageo.com/pdf/Pu-RC0603_51_PbFree_L_2.pdf; AEC Grade: N/A
R28 R33 = CMP-0025899-5: RES, 1.0 k, 5%, 0.1 W, 0603; Manufacturer: Yageo; Power_W: 100mW; TempCo: 100 ppm/C; Value_Code: 1k00; Value: 1.0k; EIA_Code: E24; Res_ohm: 1k; SizeX_mm: 1.6; SizeY_mm: 0.8; SizeZ_mm: 1; Value2: 0.1W; SizeArea_mm2: 1.28; AEC Qualified: N; VDC_V: 75V; AEC Category: Q200; SizeAreaWB_mm2: 4.68; Supplier Part Number 2: 603-RC0603JR-071KL; Supplier 2: Mouser; Supplier Part Number 3: 9233385; Supplier 3: Farnell; RoHS: Y; Value1: 5%; MountType: SMT; Supplier 1: Digi-Key; PackageReference: 0603; Tolerance_%: 5%; CompType: Resistor; PartNumber: RC0603JR-071KL; ComponentLink1Description: Datasheet link; Supplier Part Number 1: 311-1.0KGRCT-ND; Technology: Thick Film; ComponentLink1URL: http://www.yageo.com/pdf/Pu-RC0603_51_PbFree_L_2.pdf; AEC Grade: N/A
R32 = CMP-0025885-5: RES, 0, 5%, 0.1 W, 0603; Manufacturer: Yageo; Power_W: 100mW; TempCo: 200 ppm/C; Value_Code: 0000; Value: 0; EIA_Code: E24; SizeX_mm: 1.6; SizeZ_mm: 1; Value2: 0.1W; SizeArea_mm2: 1.28; AEC Qualified: N; VDC_V: 75V; AEC Category: Q200; SizeY_mm: 0.8; SizeAreaWB_mm2: 4.68; Supplier Part Number 2: 603-RC0603JR-070RL; Supplier 2: Mouser; Supplier Part Number 3: 9233130; Supplier 3: Farnell; RoHS: Y; Value1: 5%; MountType: SMT; Supplier 1: Digi-Key; PackageReference: 0603; Tolerance_%: 5%; Res_ohm: 0; CompType: Resistor; PartNumber: RC0603JR-070RL; ComponentLink1Description: Datasheet link; Supplier Part Number 1: 311-0.0GRCT-ND; Technology: Thick Film; ComponentLink1URL: http://www.yageo.com/pdf/Pu-RC0603_51_PbFree_L_2.pdf; AEC Grade: N/A
R34 R36 = CMP-0022928-4: RES, 22.0, 1%, 0.1 W, 0603; Manufacturer: Yageo; Power_W: 100mW; TempCo: 100 ppm/C; Value_Code: 22R0; Value: 22.0; Res_ohm: 22; SizeX_mm: 1.6; SizeY_mm: 0.8; SizeZ_mm: 1; Value2: 0.1W; SizeArea_mm2: 1.28; AEC Qualified: N; VDC_V: 75V; AEC Category: Q200; SizeAreaWB_mm2: 4.68; ComponentLink1URL: http://www.yageo.com/pdf/Pu-RC0603_51_PbFree_L_2.pdf; Supplier Part Number 2: 603-RC0603FR-0722RL; Supplier 2: Mouser; Supplier Part Number 3: 9238280; Supplier 3: Farnell; RoHS: Y; Value1: 1%; MountType: SMT; Supplier 1: Digi-Key; PackageReference: 0603; Tolerance_%: 1%; CompType: Resistor; PartNumber: RC0603FR-0722RL; ComponentLink1Description: Datasheet link; Supplier Part Number 1: 311-22.0HRCT-ND; Technology: Thick Film; AEC Grade: N/A
R37 = CMP-0022684-3: RES, 10.0 k, 1%, 0.1 W, 0603; Manufacturer: Panasonic; Power_W: 100mW; TempCo: 100 ppm/C; Value_Code: 10k0; U/M: EA; Value: 10.0k; EIA_Code: E96; Res_ohm: 10k; SizeX_mm: 1.6; SizeY_mm: 0.8; SizeZ_mm: 1; Value2: 0.1W; SizeArea_mm2: 1.28; VDC_V: 75V; AEC Category: Q200; Supplier Part Number 2: 64R5309; Publisher: Texas Instruments; Supplier 2: Newark; Supplier Part Number 3: 667-ERJ-3EKF1002V; Supplier 3: Mouser; Published: 2008-06-26; RoHS: Y; Value1: 1%; MountType: SMT; Supplier 1: Digi-Key; PackageReference: 0603; Tolerance_%: 1%; CompType: Resistor; LatestRevisionDate: 2017-03-09; PartNumber: ERJ-3EKF1002V; AEC Qualified: ?; ComponentLink1Description: Datasheet link; Supplier Part Number 1: P10.0KHCT-ND; Technology: Thick Film; ComponentLink1URL: http://industrial.panasonic.com/www-data/pdf/AOA0000/AOA0000CE2.pdf
R38 = CMP-0022981-5: RES, 2.05 k, 1%, 0.1 W, 0603; Manufacturer: Yageo; Power_W: 100mW; TempCo: 100 ppm/C; Value_Code: 2k05; Value: 2.05k; EIA_Code: E96; SizeX_mm: 1.6; SizeY_mm: 0.8; SizeZ_mm: 1; Value2: 0.1W; SizeArea_mm2: 1.28; AEC Qualified: N; VDC_V: 75V; AEC Category: Q200; SizeAreaWB_mm2: 4.68; Supplier Part Number 2: 603-RC0603FR-072K05L; Supplier Part Number 3: 1117250; Supplier 3: Farnell; RoHS: Y; Value1: 1%; MountType: SMT; Supplier 1: Digi-Key; PackageReference: 0603; Tolerance_%: 1%; Res_ohm: 2.05k; CompType: Resistor; PartNumber: RC0603FR-072K05L; Supplier 2: Mouser; ComponentLink1Description: Datasheet link; Supplier Part Number 1: 311-2.05KHRCT-ND; Technology: Thick Film; ComponentLink1URL: http://www.yageo.com/pdf/Pu-RC0603_51_PbFree_L_2.pdf; AEC Grade: N/A
R39 = CMP-0025743-4: RES, 1.0, 5%, 0.1 W, AEC-Q200 Grade 0, 0603; Manufacturer: Vishay-Dale; Power_W: 100mW; TempCo: 200 ppm/C; Value_Code: 1R00; Value: 1.0; EIA_Code: E24; Res_ohm: 1; SizeX_mm: 1.6; SizeY_mm: 0.8; Value2: 0.1W; SizeArea_mm2: 1.28; AEC Qualified: Y; VDC_V: 75V; AEC Category: Q200; AEC Grade: 0; ComponentLink1URL: http://www.vishay.com/docs/20035/dcrcwe3.pdf; Supplier Part Number 2: 59M6759; Supplier 2: Newark; Supplier Part Number 3: 71-CRCW0603J-1-E3; Supplier 3: Mouser; RoHS: E; Value1: 5%; MountType: SMT; Supplier 1: Digi-Key; PackageReference: 0603; Tolerance_%: 5%; SizeZ_mm: 1; CompType: Resistor; PartNumber: CRCW06031R00JNEA; ComponentLink1Description: Datasheet link; Supplier Part Number 1: 541-1.0GCT-ND; Technology: Thick Film
R41 R42 = CMP-0023341-3: RES, 10.0 k, 1%, 0.1 W, AEC-Q200 Grade 0, 0603; Manufacturer: Stackpole Electronics Inc; Power_W: 100mW; TempCo: 100 ppm/C; Value_Code: 10k0; U/M: EA; Value: 10.0k; EIA_Code: E96; Res_ohm: 10k; SizeX_mm: 1.6; SizeY_mm: 0.8; SizeZ_mm: 1; Value2: 0.1W; SizeArea_mm2: 1.28; AEC Qualified: Y; VDC_V: 75V; AEC Grade: 0; AEC Category: Q200; Supplier Part Number 2: 78Y4027; Publisher: Texas Instruments; Supplier 2: Newark; Published: 2008-06-26; RoHS: Y; Value1: 1%; MountType: SMT; Supplier 1: Digi-Key; PackageReference: 0603; Tolerance_%: 1%; CompType: Resistor; LatestRevisionDate: 2017-03-09; PartNumber: RMCF0603FT10K0; ComponentLink1Description: Datasheet link; Supplier Part Number 1: RMCF0603FT10K0CT-ND; Technology: Thick Film; ComponentLink1URL: https://www.seielect.com/Catalog/SEI-RMCF_RMCP.pdf
R43 R44 R49 R50 = CMP-0082531-1: RES, 3.30 k, 1%, 0.1 W, AEC-Q200 Grade 0, 0603; Manufacturer: Vishay-Dale; Power_W: 100mW; TempCo: 100 ppm/C; SizeAreaWB_mm2: 4.68; Value_Code: 3k30; Value: 3.30k; Res_ohm: 3.3k; SizeX_mm: 1.6; SizeY_mm: 0.8; SizeZ_mm: 1; Value2: 0.1W; SizeArea_mm2: 1.28; AEC Qualified: Y; VDC_V: 75V; AEC Grade: 0; AEC Category: Q200; ComponentLink1URL: http://www.vishay.com/docs/20035/dcrcwe3.pdf; Supplier Part Number 2: 52K8376; Supplier 2: Newark; Supplier Part Number 3: 71-CRCW0603-3.3K-E3; Supplier 3: Mouser; RoHS: E; Value1: 1%; MountType: SMT; Supplier 1: Digi-Key; PackageReference: 0603; Tolerance_%: 1%; CompType: Resistor; PartNumber: CRCW06033K30FKEA; ComponentLink1Description: Datasheet link; Supplier Part Number 1: 541-3.30KHCT-ND; Technology: Thick Film
R45-R48 = CMP-0023285-5: RES, 80.6 k, 1%, 0.1 W, 0603; Manufacturer: Yageo; Power_W: 100mW; TempCo: 100 ppm/C; Value_Code: 80k6; EIA_Code: E96; SizeX_mm: 1.6; SizeY_mm: 0.8; SizeZ_mm: 1; Value2: 0.1W; Value: 80.6k; SizeArea_mm2: 1.28; AEC Qualified: N; VDC_V: 75V; AEC Category: Q200; SizeAreaWB_mm2: 4.68; Supplier Part Number 2: 603-RC0603FR-0780K6L; Supplier 2: Mouser; Supplier Part Number 3: 4760359; Supplier 3: Farnell; RoHS: Y; Value1: 1%; MountType: SMT; Supplier 1: Digi-Key; PackageReference: 0603; Tolerance_%: 1%; Res_ohm: 80.6k; CompType: Resistor; PartNumber: RC0603FR-0780K6L; ComponentLink1Description: Datasheet link; Supplier Part Number 1: 311-80.6KHRCT-ND; Technology: Thick Film; ComponentLink1URL: http://www.yageo.com/pdf/Pu-RC0603_51_PbFree_L_2.pdf; AEC Grade: N/A
U8 = CMP-0093958-1: Mixed-Signal Microcontrollers; Part Number: MSPM0G1507SRGZ; Manufacturer: Texas Instruments; Data Bus Width: 32bits; Number Of I/Os: 44; Standoff Height: 0mm; Number Of Adc Channels: 15; SizeZ_mm: 1mm; Memory Type: FLASH; Min Supply Voltage: 1.62V; TaMax_C: +125°C; Ram Size: 32KBytes; Number Of Uart Channels: 4; Number Of I2C Channels: 2; TJmax_C: +130°C; Memory Size: 128KBytes; Number Of Cores: 1; Number Of Timers/Counters: 7; Frequency_Fixed: 80MHz; Interface: I2C,SPI,UART,LIN,IrDA,SMBus; Core Architecture: ARM Cortex-M0+; Number Of Pwm Channels: 14; Max Supply Voltage: 3.6V; TaMin_C: -40°C; AEC Qualified: No; PackageReference: VQFN48; Operating Temperature Range: -40°C to +125°C; RoHS: UNKNOWN; helpURL: https://upverter.com/upn/revision/6fcc80dadea5a972/; Number Of Spi Channels: 2; Number Of A/D Converters: 2; PartNumber: MSPM0G1506SRGZ; Datasheet Path: datasheets/IC-MSPM0G1507SRGZ.pdf
U9 U11 U13 = CMP-0093650-2: -4-V to 110-V, Bidirectional, Ultra-Precise Current Sense Amplifier With Enhanced PWM Rejection; Manufacturer: Texas Instruments; Input Bias Current: 40uA; Response Time: 1.5us; TaMax_C: +125°C; Min Supply Voltage: 2.7V; Bandwidth: 1MHz; SizeZ_mm: 1.1mm; Number Of Channels: 1; Standoff Height: 0mm; Max Supply Voltage: 20V; Input Offset Voltage: 0.002mV; TJmax_C: +150°C; AEC Category: Q200; CompType: IC; TaMin_C: -40°C; Voltage Gain: 0.1V/mV; AEC Qualified: No; Nominal Supply Current: 2.5mA; Part Number: INA241A4IDDF; ComponentLink1Description: Datasheet Link; ComponentLink2URL: http://www.ti.com/product/GPN; ComponentLink3URL: http://www.ti.com/product/GPN/datasheet; Operating Temperature Range: -40°C to +125°C; PartNumber: INA241A4IDDF; ComponentLink1URL: http://www.ti.com/lit/ds/symlink/GPN.pdf; Datasheet Path: datasheets/IC-INA241A4DDF.pdf; RoHS: UNKNOWN; helpURL: https://upverter.com/upn/revision/fe766e3b851c7aea/; ComponentLink3Description: Online Datasheet; PackageReference: SOT-23-8; ComponentLink2Description: Product Folder
U12 = CMP-0074735-2: Factory Programmed Temperature Window Comparator, DRL0006A (SOT-OTHER-6); Alternate PartNumber: TMP303CDRLT; Manufacturer: Texas Instruments; SizeZ_mm: 0.6; SizeX_mm: 1.6; SizeArea_mm2: 2.56; CompType: IC; U/M: EA; SizeAreaWB_mm2: 6.76; ComponentLink1URL: http://www.ti.com/lit/ds/symlink/tmp303.pdf; Publisher: Texas Instruments; PackageDescription: SOT-OTHER-6; SizeY_mm: 1.6; PackageReference: DRL0006A; LatestRevisionDate: 2017-06-26; RoHS: Y; MountType: SMT; PartNumber: TMP303CDRLR; Alternate Manufacturer: Texas Instruments; ComponentLink1Description: Datasheet Link; Supplier Part Number 1: 296-47165-1-ND; Supplier 1: Digi-Key